# Altium schematic sheet LCD-Connecteur-ST7920.SchDoc: LCD - Connecteurs
size Letter; ApprovedBy: kc; Organization: Cegep Limoilou; Address1: 1300, 8e Avenue; Address2: Québec, QC; Address3: Canada; Address4: G1J 5L5; SheetNumber: 9; SheetTotal: 10
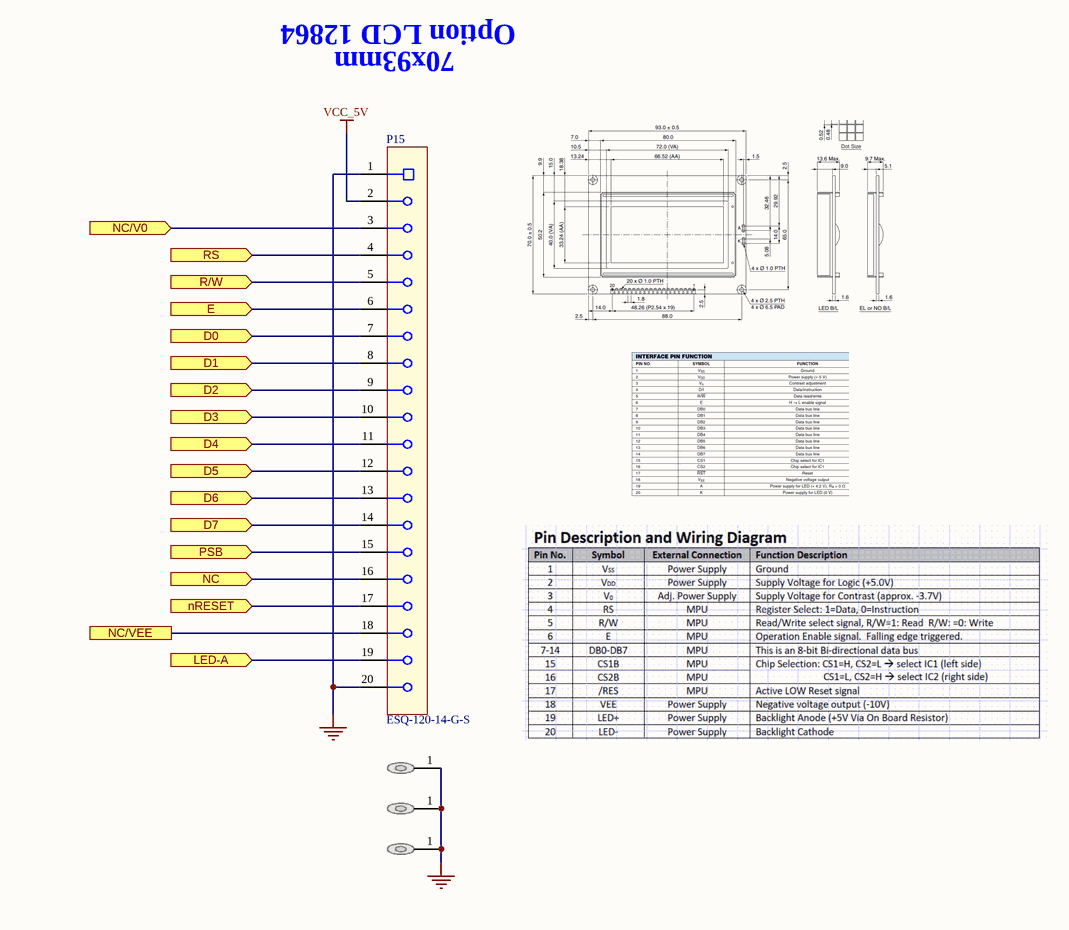
[diagram p0: LCD-Connecteur-ST7920.SchDoc]

## Parts
MH9  DNP  [MP_M-Hole_M2.5x0.45mm_LOOSE-FIT]  (value not drawn)  (no BOM)
MH10  DNP  [MP_M-Hole_M2.5x0.45mm_LOOSE-FIT]  (value not drawn)  (no BOM)
MH11  DNP  [MP_M-Hole_M2.5x0.45mm_LOOSE-FIT]  (value not drawn)  (no BOM)
P15  ESQ-120-14-G-S  [CONN-SKT-20POS-100MIL]

## Ports
D0 (in, see Affichage-LCD[3C], LCD-Connecteur-KS0108[2B]), D1 (in, see Affichage-LCD[3C], LCD-Connecteur-KS0108[2B]), D2 (in, see Affichage-LCD[3C], LCD-Connecteur-KS0108[2B]), D3 (in, see Affichage-LCD[3C], LCD-Connecteur-KS0108[2B]), D4 (in, see Affichage-LCD[3C], LCD-Connecteur-KS0108[2B]), D5 (in, see Affichage-LCD[3C], LCD-Connecteur-KS0108[2B]), D6 (in, see Affichage-LCD[3C], LCD-Connecteur-KS0108[2B]), D7 (in, see Affichage-LCD[3C], LCD-Connecteur-KS0108[2B]), E (in, see Affichage-LCD[3D], LCD-Connecteur-KS0108[2C]), LED-A (in, see Affichage-LCD[3C], LCD-Connecteur-KS0108[2C]), NC (in, see Affichage-LCD[3C]), NC/V0 (in, see Affichage-LCD[3C]), NC/VEE (see Affichage-LCD[3C]), nRESET (in, see Affichage-LCD[3C], LCD-Connecteur-KS0108[2C]), PSB (in, see Affichage-LCD[3C]), R/W (in, see Affichage-LCD[3C], LCD-Connecteur-KS0108[2C]), RS (in, see Affichage-LCD[3D])

## Nets
GND: MH9.1 MH10.1 MH11.1 P15.1 P15.20
VCC_5V: P15.2
D0: P15.7 ; port D0
D1: P15.8 ; port D1
D2: P15.9 ; port D2
D3: P15.10 ; port D3
D4: P15.11 ; port D4
D5: P15.12 ; port D5
D6: P15.13 ; port D6
D7: P15.14 ; port D7
E: P15.6 ; port E
LED-A: P15.19 ; port LED-A
NC: P15.16 ; port NC
NC/V0: P15.3 ; port NC/V0
NC/VEE: P15.18 ; port NC/VEE
nRESET: P15.17 ; port nRESET
PSB: P15.15 ; port PSB
R/W: P15.5 ; port R/W
RS: P15.4 ; port RS

## Notes on the sheet
- Option LCD 12864
- 70x93mm
- Titre :
- Conception :
- Date :
- Approbation :
- Heure :
- Révision :
- Feuille
- de
- Fichier :

## Library data of the parts
MH9-MH11 = MH-2.5MM: Mounting Hole 2.5mm w/ Flat Washer; Manufacturer Part Number 1: DNP; Value: DNP; Supplier Part Number 1: N/A
P15 = CONN-100MIL-SKT-01X20: CONN SOCKET 20POS 2.54MM; Manufacturer 1: Megastar; Manufacturer Part Number 1: ZX-PM2.54-1-20PY; Code CEGEP: KCONDIV0053; Localisation: R13-B035; Mounting Technology: TH; Supplier 1: LCSC; Supplier Part Number 1: C7499336